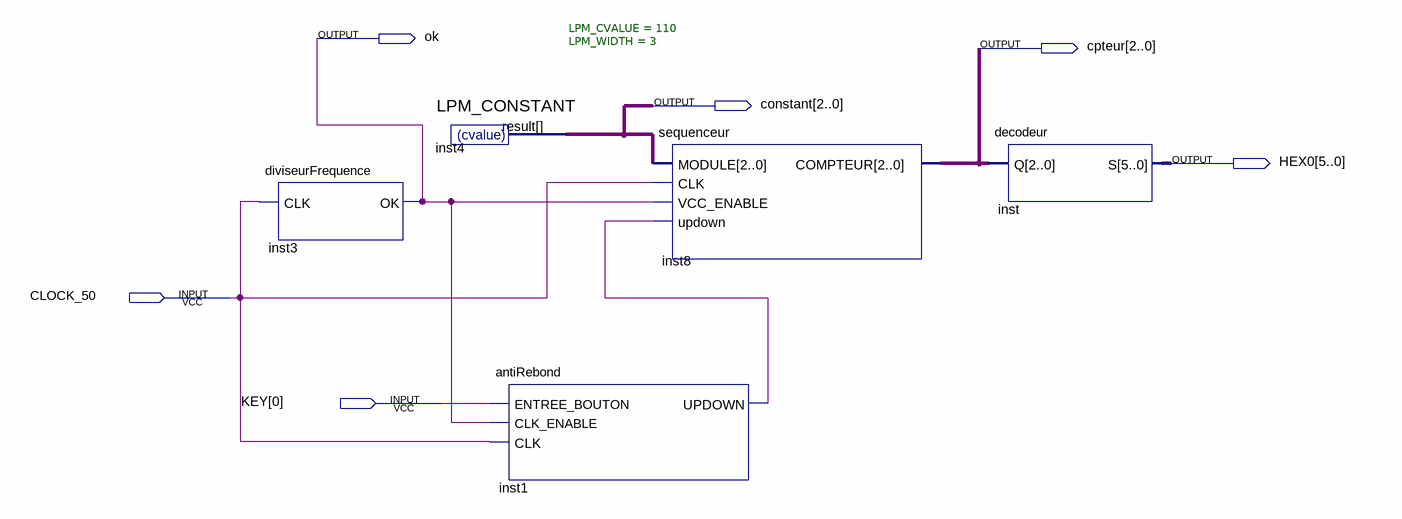
[diagram p0: schematic sheet]
// Quartus schematic Affichage7Segment.bdf as structural Verilog: 5 symbols, 6 pins
module Affichage7Segment (
  input  CLOCK_50,
  input  [0:0] KEY,
  output ok,
  output [2:0] cpteur,
  output [2:0] constant,
  output [5:0] HEX0
);

  wire inst1_updown;

  diviseurFrequence inst3 (.CLK(CLOCK_50), .OK(ok));
  LPM_CONSTANT #(.LPM_CVALUE(110), .LPM_WIDTH(3)) inst4 (.result(constant));
  antiRebond inst1 (.ENTREE_BOUTON(KEY[0]), .CLK_ENABLE(ok), .CLK(CLOCK_50), .UPDOWN(inst1_updown));
  sequenceur inst8 (.MODULE(constant), .CLK(CLOCK_50), .VCC_ENABLE(ok), .updown(inst1_updown), .COMPTEUR(cpteur));
  decodeur inst (.Q(cpteur), .S(HEX0));
endmodule
